# Altium schematic sheet SIM900.SchDoc: SIM900
size A4; Title2: NASCO ALARM INTERFACE
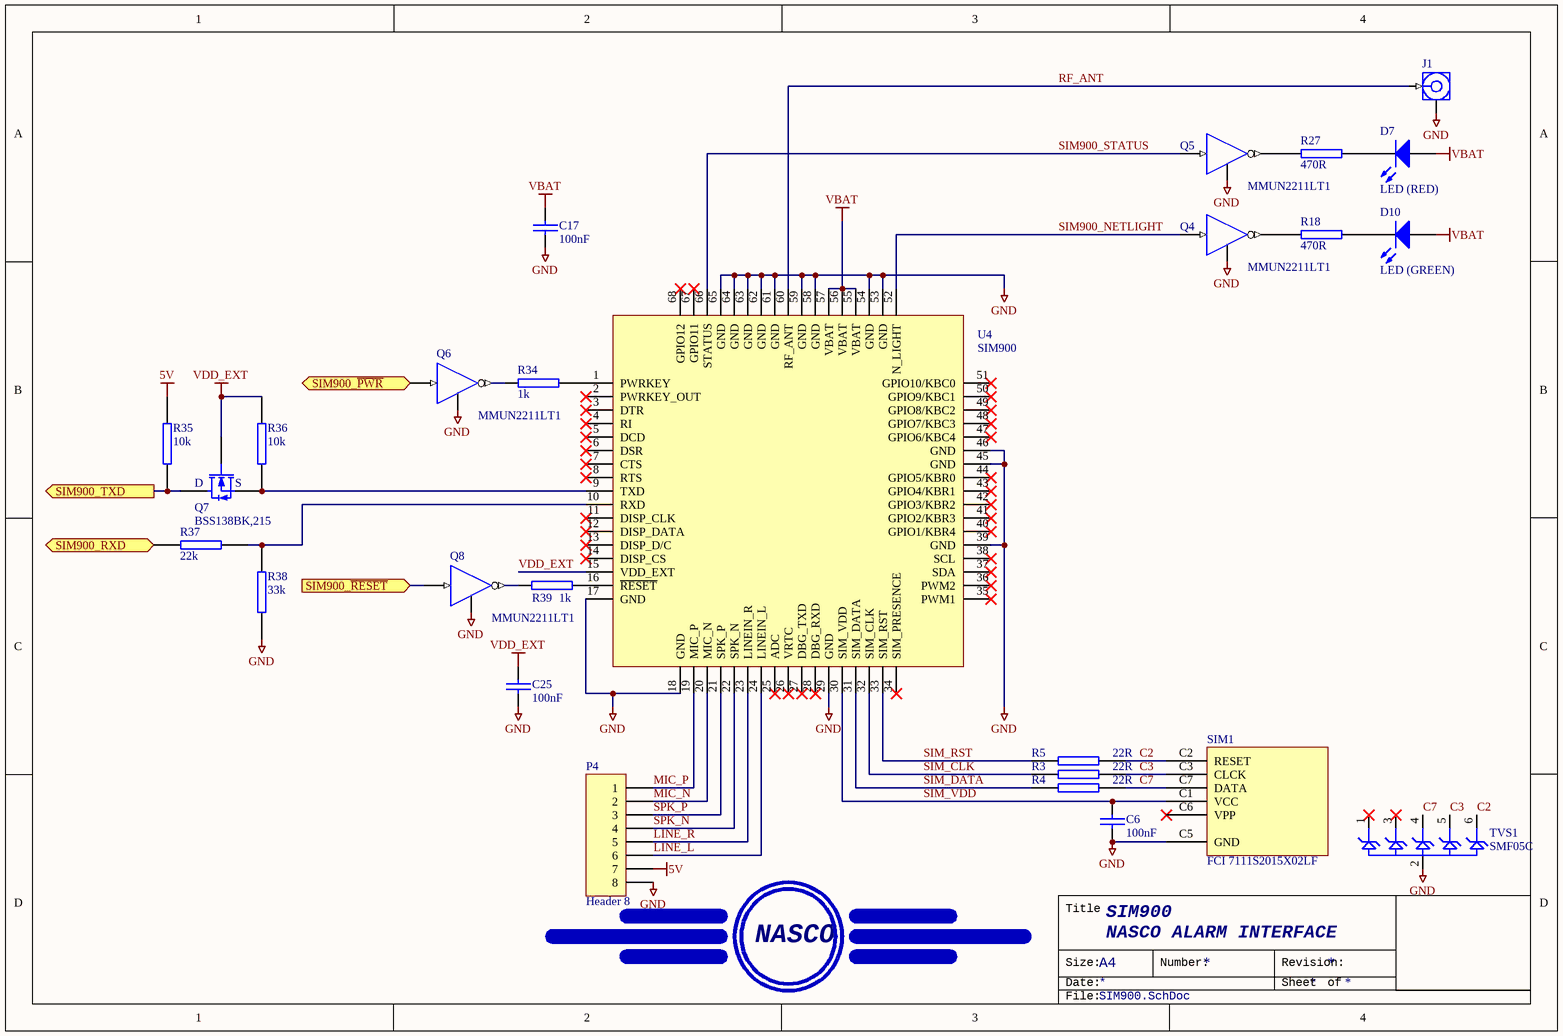
[diagram p0: SIM900.SchDoc]

## Parts
?  (no value)  (no BOM)
C6  100nF  [CAP (3D) - 0603]
C17  100nF  [CAP (3D) - 0603]
C25  100nF  [CAP (3D) - 0603]
D7  LED (RED)  [LED(3D) 3MM RIGHT ANGLE RED]
D10  LED (GREEN)  [LED(3D) 3MM RIGHT ANGLE GREEN]
J1  SMA  [SMA EDGE MOUNT]  (value not drawn)
P4  Header 8  [HDR1X8 (3D)]  (no BOM)
Q4  MMUN2211LT1  [SOT23-3L]
Q5  MMUN2211LT1  [SOT23-3L]
Q6  MMUN2211LT1  [SOT23-3L]
Q7  BSS138BK,215  [SOT23-3L]
Q8  MMUN2211LT1  [SOT23-3L]
R3  22R  [RES (3D) - 0603]
R4  22R  [RES (3D) - 0603]
R5  22R  [RES (3D) - 0603]
R18  470R  [RES (3D) - 0603]
R27  470R  [RES (3D) - 0603]
R34  1k  [RES (3D) - 0603]
R35  10k  [RES (3D) - 0603]
R36  10k  [RES (3D) - 0603]
R37  22k  [RES (3D) - 0603]
R38  33k  [RES (3D) - 0603]
R39  1k  [RES (3D) - 0603]
SIM1  FCI 7111S2015X02LF  [SIM CARD]
TVS1  SMF05C  [SOT-363]
U4  SIM900  [SIM900]

## Ports
SIM900_RXD (in), SIM900_TXD (out), SIM900_~{PWR} (in), SIM900_~{RESET} (in)

## Nets
5V: P4.7 R35.2
GND: C6.2 C17.2 C25.2 J1.2(GND) P4.8 Q4.2(E) Q5.2(E) Q6.2(E) Q8.2(E) R38.2 SIM1.C5(GND) TVS1.2(A) U4.17(GND) U4.18(GND) U4.29(GND) U4.39(GND) U4.45(GND) U4.46(GND) U4.53(GND) U4.54(GND) U4.58(GND) U4.59(GND) U4.61(GND) U4.62(GND) U4.63(GND) U4.64(GND) U4.65(GND)
VBAT: C17.1 D7.1(A) D10.1(A) U4.55(VBAT) U4.56(VBAT) U4.57(VBAT)
VDD_EXT: C25.1 Q7.1(G) R36.2 U4.15(VDD_EXT)
C2: R5.2 SIM1.C2(RESET) TVS1.6(K5)
C3: R3.2 SIM1.C3(CLCK) TVS1.5(K4)
C7: R4.2 SIM1.C7(DATA) TVS1.4(K3)
LINE_L: P4.6 U4.24(LINEIN_L)
LINE_R: P4.5 U4.23(LINEIN_R)
MIC_N: P4.2 U4.20(MIC_N)
MIC_P: P4.1 U4.19(MIC_P)
RF_ANT: J1.1(Signal) U4.60(RF_ANT)
SIM900_NETLIGHT: Q4.1(B) U4.52(N_LIGHT)
SIM900_~{PWR}: Q6.1(B) ; port SIM900_~{PWR}
SIM900_~{RESET}: Q8.1(B) ; port SIM900_~{RESET}
SIM900_RXD: R37.1 ; port SIM900_RXD
SIM900_STATUS: Q5.1(B) U4.66(STATUS)
SIM900_TXD: Q7.3(D) R35.1 ; port SIM900_TXD
SIM_CLK: R3.1 U4.32(SIM_CLK)
SIM_DATA: R4.1 U4.31(SIM_DATA)
SIM_RST: R5.1 U4.33(SIM_RST)
SIM_VDD: C6.1 SIM1.C1(VCC) U4.30(SIM_VDD)
SPK_N: P4.4 U4.22(SPK_N)
SPK_P: P4.3 U4.21(SPK_P)
NetD7_2: D7.2(K) R27.2
NetD10_2: D10.2(K) R18.2
NetQ4_3: Q4.3(C) R18.1
NetQ5_3: Q5.3(C) R27.1
NetQ6_3: Q6.3(C) R34.1
NetQ7_2: Q7.2(S) R36.1 U4.9(TXD)
NetQ8_3: Q8.3(C) R39.1
NetR34_2: R34.2 U4.1(PWRKEY)
NetR37_2: R37.2 R38.1 U4.10(RXD)
NetR39_2: R39.2 U4.16(~{RESET})

Not connected (* = marked no-connect by the designer): SIM1 C6(VPP)*; TVS1 1(K1)* 3(K2)*; U4 2(PWRKEY_OUT)* 3(DTR)* 4(RI)* 5(DCD)* 6(DSR)* 7(CTS)* 8(RTS)* 11(DISP_CLK)* 12(DISP_DATA)* 13(DISP_D/C)* 14(DISP_CS)* 25(ADC)* 26(VRTC)* 27(DBG_TXD)* 28(DBG_RXD)* 34(SIM_PRESENCE)* 35(PWM1)* 36(PWM2)* 37(SDA)* 38(SCL)* 40(GPIO1/KBR4)* 41(GPIO2/KBR3)* 42(GPIO3/KBR2)* 43(GPIO4/KBR1)* 44(GPIO5/KBR0)* 47(GPIO6/KBC4)* 48(GPIO7/KBC3)* 49(GPIO8/KBC2)* 50(GPIO9/KBC1)* 51(GPIO10/KBC0)* 67(GPIO11)* 68(GPIO12)*

## Notes on the sheet
- Title
- NASCO
- Size:
- Date:
- A4
- Number:
- Revision:
- Sheet
- of
- File:

## Library data of the parts
? = NASCO_LOGO: LOGO
C6 = CAP SMD 0603 100nF: CAPACITOR SMD 0603; Manufacturer: Murata; Manufacturer Part No.: GCM188R71C104KA37D; Mouser Part no.: 81-GCM188R71C104KA7D; Web link: http://au.mouser.com/ProductDetail/Murata/GCM188R71C104KA37D/?qs=aEuGZpxfbxWKAxwYn%252beTMg%3d%3d; value: 100nF
C17 = CAP: CAPACITOR SMD 0603; Manufacturer: Murata; Manufacturer Part No.: GRM155R61C104KA88D; value: 100nF; Mouser Part no.: 81-GRM155R61C104KA8D; Web link: http://au.mouser.com/ProductDetail/Murata/GRM155R61C104KA88D/?qs=sGAEpiMZZMvQvaS66kI3TkNFPW5pBWErgqKrdkfeYZ0%3d
C25 = CAP SMD 0603 1nF: CAPACITOR SMD 0603; Manufacturer: Murata; Manufacturer Part No.: GCM1885C1H102JA16D; Mouser Part no.: 81-GCM1885C1H102JA6D; Web link: http://au.mouser.com/ProductDetail/Murata/GCM1885C1H102JA16D/?qs=aEuGZpxfbxWracuMmQWyxw%3d%3d; value: 100nF
D7 = LED 3mm RED: 3mm RED LED; Manufacturer: Lite-On; Manufacturer Part No.: LTL-4261NR; value: RED 3mm; Mouser Part no.: 859-LTL-4261NR; Web link: http://au.mouser.com/ProductDetail/Lite-On/LTL-307E/?qs=sGAEpiMZZMs4quMj8r4lmhnQMFVtnV3yedxNjWAKgTA%3d
D10 = LED 3mm GREEN: 3mm GREEN LED; Manufacturer: Lite-On; Manufacturer Part No.: LTL-1CHG; value: GREEN 3mm; Mouser Part no.: 859-LTL-1CHG; Web link: http://au.mouser.com/ProductDetail/Lite-On/LTL-1CHG/?qs=sGAEpiMZZMs4quMj8r4lmsfF1SjbyuBqGk7sQVhKrYk%3d
J1 = SMA 142-0701-801: JOHNSON / EMERSON SMA PCB EDGE; Manufacturer: Johnson / Emerson; Manufacturer Part No.: 142-0701-801; Mouser Part no.: 530-142-0701-801; value: SMA; Web link: http://au.mouser.com/ProductDetail/Emerson-Connectivity-Solutions/142-0701-801/?qs=%2fha2pyFadui1v%252bStuw7JbRg0ffTvIaD43efyyE%252b%252b43dWi%252bwW6373fw%3d%3d
P4 = Header 8: Header, 8-Pin; value: 0.100" HEADER
Q4-Q6 Q8 = MMUN221LT1 NPN DIGITAL TRANSISTOR: Manufacturer: ON Semiconductor; Manufacturer Part No.: MMUN2211LT1G; value: NPN; Mouser Part no.: 863-MMUN2211LT1G; Web link: http://au.mouser.com/ProductDetail/ON-Semiconductor/MMUN2211LT1G/?qs=sGAEpiMZZMt32xmUYxteeYvHZcSNQKJZCO%252bIh%252bS%252bXZs%3d
Q7 = BSS138BK,215 SOT23: N-Channel MOSFET; Manufacturer: NXP Semiconductors; Value: BSS138BK,215; Manufacturer Part No.: BSS138BK,215; Mouser Part no.: 771-BSS138BK215; Web link: http://au.mouser.com/ProductDetail/NXP/BSS138BK215/?qs=%2fha2pyFaduhOCsXH6DamaYx2vFX9CGnGyFNFIdZCCfo2MZSmQFQsKQ%3d%3d
R3-R5 = RES SMD 0603 0R: RESISTOR SMD 0603 0R; Manufacturer: Xicon; Manufacturer Part No.: 301-22-RC; Mouser Part no.: 301-22-RC; Web link: http://au.mouser.com/ProductDetail/Xicon/301-22-RC/?qs=sGAEpiMZZMu61qfTUdNhG77xSY1jRpIyXwGVN4E99m8%3d; value: 22R
R18 R27 = RES SMD 0603 590R: RESISTOR SMD 0603 590R; Manufacturer: Vishay; Manufacturer Part No.: CRCW0603470RJNEA; Mouser Part no.: 71-CRCW0603J-470-E3; Web link: http://au.mouser.com/ProductDetail/Vishay-Dale/CRCW0603470RJNEA/?qs=sGAEpiMZZMtlubZbdhIBIDQnfxtYKdcjBa1CNCbPnm4%3d; value: 470R
R34 R39 = RES SMD 0603 1k: RESISTOR SMD 0603 1k; Manufacturer: Bourns; Manufacturer Part No.: CR0603-JW-102ELF; Mouser Part no.: 652-CR0603-JW-102ELF; Web link: http://au.mouser.com/ProductDetail/Bourns/CR0603-JW-102ELF/?qs=sGAEpiMZZMu61qfTUdNhG2nPoCjtvs%252bRXTOJv8O9Kbk%3d; value: 1k
R35 R36 = RES SMD 0603 10k: RESISTOR SMD 0603 10k; Manufacturer: Bourns; Manufacturer Part No.: CR0603FX-1002ELF; Mouser Part no.: 652-CR0603FX-1002ELF; Web link: http://au.mouser.com/Search/Refine.aspx?Keyword=652-CR0603FX-1002ELF; value: 10k
R37 = RES SMD 0603 1k: RESISTOR SMD 0603 1k; Manufacturer: Bourns; Manufacturer Part No.: CR0603-FX-4223ELF; Mouser Part no.: 652-CR0603FX-4223ELF; Web link: http://au.mouser.com/ProductDetail/Bourns/CR0603-FX-4223ELF/?qs=CCIlxZRRv7hqply3rAXy4hrq0%2fcMGkZy; value: 22k
R38 = RES SMD 0603 1k: RESISTOR SMD 0603 1k; Manufacturer: Vishay; Manufacturer Part No.: CRCW06033K30JNEB; Mouser Part no.: 71-CRCW06033K30JNEB; Web link: http://au.mouser.com/ProductDetail/Vishay-Dale/CRCW06033K30JNEB/?qs=sGAEpiMZZMtlubZbdhIBIGFBittgiF6Fxuh7evu4ctk%3d; value: 33k
SIM1 = FCI 7111S2015X02LF: FCI 7111S2015X02LF SIM CARD HOLDER; value: SIM1; Manufacturer: FCI; Manufacturer Part No.: 7111S2015X02LF; Mouser Part no.: 649-7111S2015X02LF; Web link: http://au.mouser.com/ProductDetail/FCI/7111S2015X02LF/?qs=%2fha2pyFaduj7uBU2gxQ%2fq23qVE2ewQPoOGeAxVKmqgNANLOlyef2cg%3d%3d
TVS1 = SMF05C: Manufacturer: ON Semiconductor; Manufacturer Part No.: SMF05CT1G; value: SMF05CT1G; Mouser Part no.: 863-SMF05CT1G; Web link: http://au.mouser.com/ProductDetail/ON-Semiconductor/SMF05CT1G/?qs=sGAEpiMZZMv50VCOoJQfutYYatoVJ2WkCxvFJNVrxzU%3d
U4 = SIM900: Manufacturer: SIMCOM; Manufacturer Part No.: SIM900; value: SIM900; Web link: http://www.aliexpress.com/store/product/SIMCOM-SIM900-module/404544_689100740.html